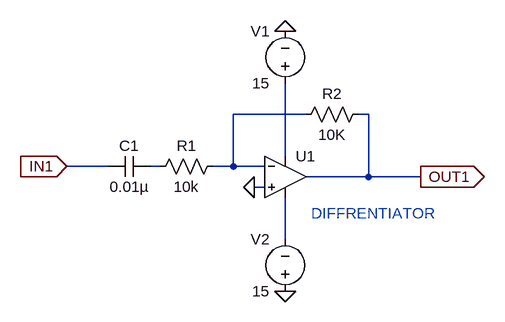
[diagram p0: schematic diffrenetiatorblock.asc]
diffrenetiatorblock.asc, the LTspice schematic file:
Version 4.1
SHEET 1 880 680
WIRE 272 64 160 64
WIRE 368 64 352 64
WIRE 240 128 240 16
WIRE -32 144 -96 144
WIRE 48 144 32 144
WIRE 160 144 160 64
WIRE 160 144 128 144
WIRE 208 144 160 144
WIRE 368 160 368 64
WIRE 368 160 272 160
WIRE 448 160 368 160
WIRE 208 176 192 176
WIRE 240 256 240 192
FLAG 240 -64 0
FLAG 240 336 0
FLAG 192 176 0
FLAG -96 144 IN1
IOPIN -96 144 In
FLAG 448 160 OUT1
IOPIN 448 160 Out
SYMBOL OpAmps\\UniversalOpAmp 240 160 R0
SYMATTR InstName U1
SYMBOL voltage 240 32 R180
WINDOW 0 24 96 Left 2
WINDOW 3 24 16 Left 2
WINDOW 123 0 0 Left 0
WINDOW 39 0 0 Left 0
SYMATTR InstName V1
SYMATTR Value 15
SYMBOL voltage 240 352 R180
WINDOW 0 24 96 Left 2
WINDOW 3 24 16 Left 2
WINDOW 123 0 0 Left 0
WINDOW 39 0 0 Left 0
SYMATTR InstName V2
SYMATTR Value 15
SYMBOL res 368 48 R90
WINDOW 0 0 56 VBottom 2
WINDOW 3 32 56 VTop 2
SYMATTR InstName R2
SYMATTR Value 10K
SYMBOL cap 32 128 R90
WINDOW 0 0 32 VBottom 2
WINDOW 3 32 32 VTop 2
SYMATTR InstName C1
SYMATTR Value 0.01µ
SYMBOL res 144 128 R90
WINDOW 0 0 56 VBottom 2
WINDOW 3 32 56 VTop 2
SYMATTR InstName R1
SYMATTR Value 10k
TEXT 280 216 Left 2 ;DIFFRENTIATOR

The netlist it stands for:
* diffrenetiatorblock.asc
X§U1 0 N001 N002 N004 OUT1 level1 Avol=1Meg GBW=10Meg Vos=0 En=0 Enk=0 In=0 Ink=0 Rin=500Meg  ; pins In+ In- V+ V- OUT
V1 N002 0 15
V2 0 N004 15
R2 OUT1 N001 10K
C1 N003 IN1 0.01µ
R1 N001 N003 10k
* DIFFRENTIATOR
.lib UniversalOpAmp1.lib
.backanno
.end